# EAGLE schematic EFP01 - Front Panel Board (EAGLE 7.4.0)

## Sheet 1 of 2: MCU
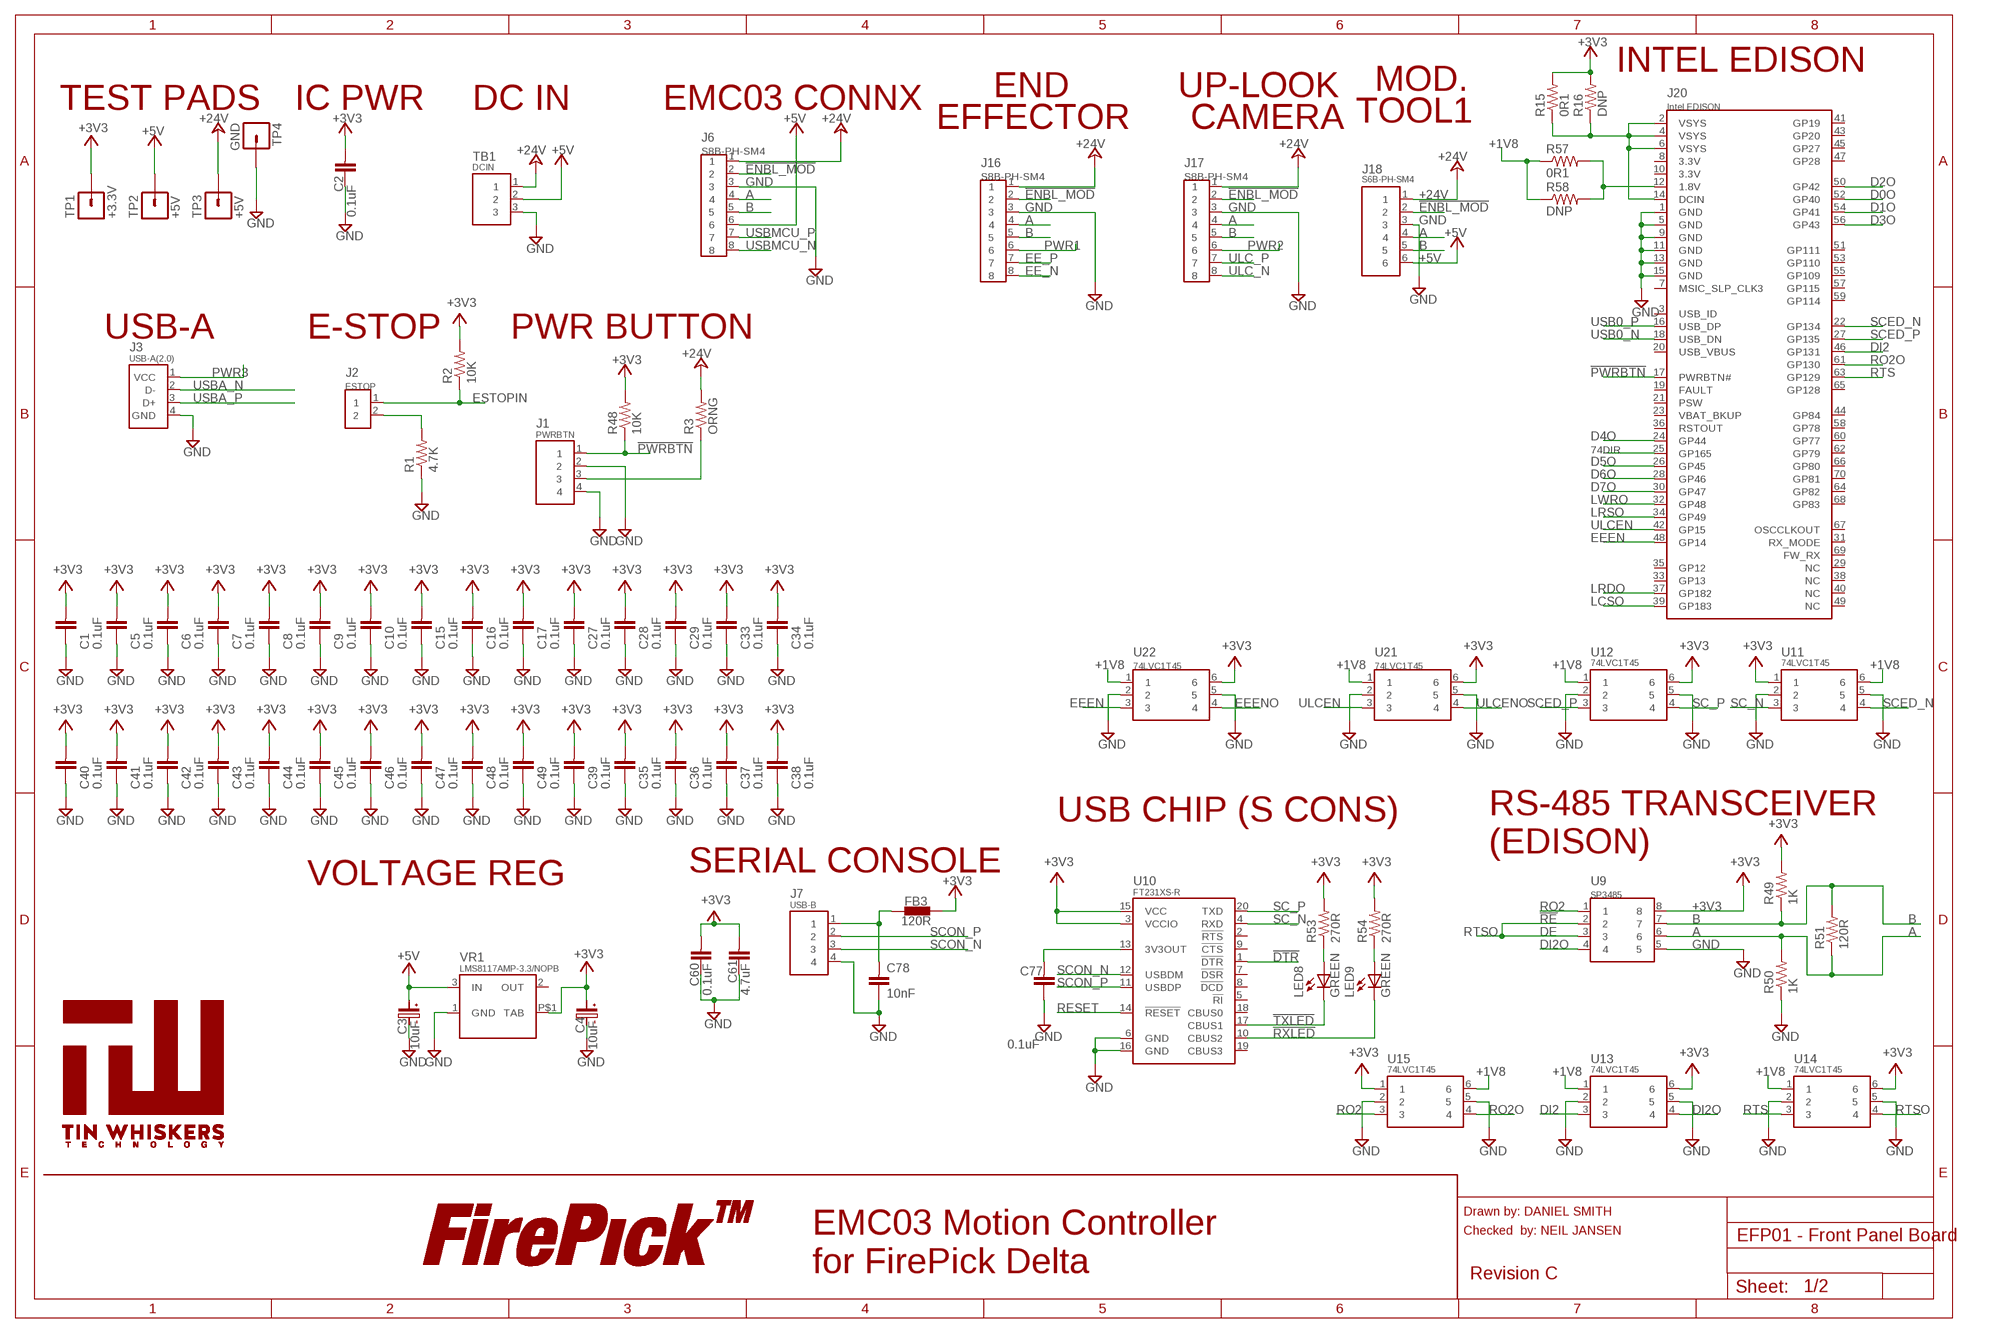
[diagram p0: schematic, sheet 1]

### Parts
C1  0.1uF  CPL-CAP-X5R-0603-0.1UF-35V  [C0603]
C2  0.1uF  CPL-CAP-X5R-0603-0.1UF-35V  [C0603]
C3  10uF  CPL-CAP-ALU-6.4MM-10UF-10V  [C-SMD-6.3MM]
C4  10uF  CPL-CAP-ALU-6.4MM-10UF-10V  [C-SMD-6.3MM]
C5  0.1uF  CPL-CAP-X5R-0603-0.1UF-35V  [C0603]
C6  0.1uF  CPL-CAP-X5R-0603-0.1UF-35V  [C0603]
C7  0.1uF  CPL-CAP-X5R-0603-0.1UF-35V  [C0603]
C8  0.1uF  CPL-CAP-X5R-0603-0.1UF-35V  [C0603]
C9  0.1uF  CPL-CAP-X5R-0603-0.1UF-35V  [C0603]
C10  0.1uF  CPL-CAP-X5R-0603-0.1UF-35V  [C0603]
C15  0.1uF  CPL-CAP-X5R-0603-0.1UF-35V  [C0603]
C16  0.1uF  CPL-CAP-X5R-0603-0.1UF-35V  [C0603]
C17  0.1uF  CPL-CAP-X5R-0603-0.1UF-35V  [C0603]
C27  0.1uF  CPL-CAP-X5R-0603-0.1UF-35V  [C0603]
C28  0.1uF  CPL-CAP-X5R-0603-0.1UF-35V  [C0603]
C29  0.1uF  CPL-CAP-X5R-0603-0.1UF-35V  [C0603]
C33  0.1uF  CPL-CAP-X5R-0603-0.1UF-35V  [C0603]
C34  0.1uF  CPL-CAP-X5R-0603-0.1UF-35V  [C0603]
C35  0.1uF  CPL-CAP-X5R-0603-0.1UF-35V  [C0603]
C36  0.1uF  CPL-CAP-X5R-0603-0.1UF-35V  [C0603]
C37  0.1uF  CPL-CAP-X5R-0603-0.1UF-35V  [C0603]
C38  0.1uF  CPL-CAP-X5R-0603-0.1UF-35V  [C0603]
C39  0.1uF  CPL-CAP-X5R-0603-0.1UF-35V  [C0603]
C40  0.1uF  CPL-CAP-X5R-0603-0.1UF-35V  [C0603]
C41  0.1uF  CPL-CAP-X5R-0603-0.1UF-35V  [C0603]
C42  0.1uF  CPL-CAP-X5R-0603-0.1UF-35V  [C0603]
C43  0.1uF  CPL-CAP-X5R-0603-0.1UF-35V  [C0603]
C44  0.1uF  CPL-CAP-X5R-0603-0.1UF-35V  [C0603]
C45  0.1uF  CPL-CAP-X5R-0603-0.1UF-35V  [C0603]
C46  0.1uF  CPL-CAP-X5R-0603-0.1UF-35V  [C0603]
C47  0.1uF  CPL-CAP-X5R-0603-0.1UF-35V  [C0603]
C48  0.1uF  CPL-CAP-X5R-0603-0.1UF-35V  [C0603]
C49  0.1uF  CPL-CAP-X5R-0603-0.1UF-35V  [C0603]
C60  0.1uF  CPL-CAP-X5R-0603-0.1UF-35V  [C0603]
C61  4.7uF  CPL-CAP-X5R-0603-4.7UF-10V  [C0603]
C77  0.1uF  CPL-CAP-X7R-0603-0.1UF-35V  [C0603]
C78  10nF  CPL-CAP-X7R-10NF-16V  [C0603]
FB3  120R  CPL-IND-FER-120OHM-2A  [F0603]
J1  PWRBTN  CPL-CON-JST-2.0MM-4P-M-SMT-VRT  [CON-JST-PH-2.0MM-4P-SMT-VRT]
J2  ESTOP  CPL-CON-JST-2.0MM-2P-M-SMT-VRT  [CON-JST-PH-2.0MM-2P-SMT-VRT]
J3  USB-A(2.0)  CPL-CON-USB-A-THRU-VERT-2.0  [USB-A-THRU-VERT-2.0]
J6  S8B-PH-SM4  CPL-CON-JST-2.0MM-8P-SMT-VRT  [CON-JST-PH-2.0MM-8P-SMT-VRT]
J7  USB-B  CPL-CON-USB-B-SMT-VERT  [USB-B(SMT)-VERT-1734517]
J16  S8B-PH-SM4  CPL-CON-JST-2.0MM-8P-SMT-VRT  [CON-JST-PH-2.0MM-8P-SMT-VRT]
J17  S8B-PH-SM4  CPL-CON-JST-2.0MM-8P-SMT-VRT  [CON-JST-PH-2.0MM-8P-SMT-VRT]
J18  S6B-PH-SM4  CPL-CON-JST-2.0MM-6P-SMT-VRT  [CON-JST-PH-2.00MM-6P-SMT-VRT]
J20  Intel EDISON  CPL-SBC-INTEL-EDISON  [DF40HC(3.0)-70DS-0.4V(51)]
LED8  GREEN  CPL-LED-0603-GREEN  [LED0603]
LED9  GREEN  CPL-LED-0603-GREEN  [LED0603]
LOGO1  LOGO-FIREPICKLARGE  [LOGO-FIREPICK]
R1  4.7K  CPL-RES-0603-4.7K-0.1W  [R0603]
R2  10K  CPL-RES-0603-10K-0.1W  [R0603]
R3  ORNG  CPL-RES-0603-0-0.1W  [R0603]
R15  0R1  CPL-RES-0603-0.1-0.1W  [R0603]
R16  DNP  CPL-RES-0603-0-0.1W  [R0603]
R48  10K  CPL-RES-0603-10K-0.1W  [R0603]
R49  1K  CPL-RES-0603-1K-0.1W  [R0603]
R50  1K  CPL-RES-0603-1K-0.1W  [R0603]
R51  120R  CPL-RES-0603-120-0.1W  [R0603]
R53  270R  CPL-RES-0603-270-0.1W  [R0603]
R54  270R  CPL-RES-0603-270-0.1W  [R0603]
R57  0R1  CPL-RES-0603-0.1-0.1W  [R0603]
R58  DNP  CPL-RES-0603-0-0.1W  [R0603]
TB1  DCIN  CPL-TBLK-SCR-3CKT-5.0MM-OST  [TBLOCK-3-5MM-OSTTH030160]
TP1  +3.3V  TPAD  [TESTPAD]
TP2  +5V  TPAD  [TESTPAD]
TP3  +5V  TPAD  [TESTPAD]
TP4  GND  TPAD  [TESTPAD]
U9  SP3485  [SOICN-8]
U10  FT231XS-R  CPL-USB-FT2321XS  [20-SSOP]
U11  74LVC1T45  CPL-TRS-74LVC1T45  [SOT-363]
U12  74LVC1T45  CPL-TRS-74LVC1T45  [SOT-363]
U13  74LVC1T45  CPL-TRS-74LVC1T45  [SOT-363]
U14  74LVC1T45  CPL-TRS-74LVC1T45  [SOT-363]
U15  74LVC1T45  CPL-TRS-74LVC1T45  [SOT-363]
U21  74LVC1T45  CPL-TRS-74LVC1T45  [SOT-363]
U22  74LVC1T45  CPL-TRS-74LVC1T45  [SOT-363]
U$1  TIN-WHISKERSTSTOP  [TIN-WHISKERS-TSTOP]
VR1  LMS8117AMP-3.3/NOPB  CPL-REG-LIN-3.3V-1A  [SOT-223]

### Nets
74DIR [power]: J20.25(GP165) ; also sheet 2
!DTR: U10.1(!DTR)
!ENBL_MOD: J6.2 J16.2 J17.2 J18.2
!PWRBTN: J1.1 J20.17(PWRBTN#) R48.1
!RXLED: LED9.C U10.10(CBUS2)
!TXLED: LED8.C U10.17(CBUS1)
+1V8: R57.1 R58.1 U11.6 U12.1 U13.1 U14.1 U15.6 U21.1 U22.1 ; also sheet 2
+3V3: C1.2 C2.2 C4.POS C5.2 C6.2 C7.2 C8.2 C9.2 C10.2 C15.2 C16.2 C17.2 C27.2 C28.2 C29.2 C33.2 C34.2 C35.2 C36.2 C37.2 C38.2 C39.2 C40.2 C41.2 C42.2 C43.2 C44.2 C45.2 C46.2 C47.2 C48.2 C49.2 C60.2 C61.2 FB3.2 R2.2 R15.2 R16.2 R48.2 R49.2 R53.2 R54.2 TP1.PAD U9.8 U10.3(VCCIO) U10.15(VCC) U11.1 U12.6 U13.6 U14.6 U15.1 U21.6 U22.6 VR1.P$1(TAB) ; also sheet 2
+5V [power]: C3.POS J6.6 J18.6 TB1.2 TP2.PAD VR1.3(IN) ; also sheet 2
+24V: J6.1 J16.1 J17.1 J18.1 R3.2 TB1.1 TP3.PAD
A: J6.4 J16.4 J17.4 J18.4 R50.2 R51.1 U9.6
B: J6.5 J16.5 J17.5 J18.5 R49.1 R51.2 U9.7
D0O: J20.52(GP40) ; also sheet 2
D1O: J20.54(GP41) ; also sheet 2
D2O: J20.50(GP42) ; also sheet 2
D3O: J20.56(GP43) ; also sheet 2
D4O: J20.24(GP44) ; also sheet 2
D5O: J20.26(GP45) ; also sheet 2
D6O: J20.28(GP46) ; also sheet 2
D7O: J20.30(GP47) ; also sheet 2
DI2: J20.46(GP131) U13.3
DI2O: U9.4 U13.4
EE_N: J16.8 ; also sheet 2
EE_P: J16.7 ; also sheet 2
EEEN: J20.48(GP14) U22.3
EEENO: U22.4 ; also sheet 2
ESTOPIN: J2.1 R2.1
GND [power]: C1.1 C2.1 C3.NEG C4.NEG C5.1 C6.1 C7.1 C8.1 C9.1 C10.1 C15.1 C16.1 C17.1 C27.1 C28.1 C29.1 C33.1 C34.1 C35.1 C36.1 C37.1 C38.1 C39.1 C40.1 C41.1 C42.1 C43.1 C44.1 C45.1 C46.1 C47.1 C48.1 C49.1 C60.1 C61.1 C77.1 C78.1 J1.2 J1.4 J3.4(GND) J6.3 J7.4 J16.3 J17.3 J18.3 J20.1(GND) J20.5(GND) J20.9(GND) J20.11(GND) J20.13(GND) J20.15(GND) R1.1 R50.1 TB1.3 TP4.PAD U9.5 U10.6(GND) U10.16(GND) U11.2 U11.5 U12.2 U12.5 U13.2 U13.5 U14.2 U14.5 U15.2 U15.5 U21.2 U21.5 U22.2 U22.5 VR1.1(GND) ; also sheet 2
LCSO: J20.39(GP183) ; also sheet 2
LRDO: J20.37(GP182) ; also sheet 2
LRSO: J20.34(GP49) ; also sheet 2
LWRO: J20.32(GP48) ; also sheet 2
N$1: C77.2 U10.13(3V3OUT)
N$2: C78.2 FB3.1 J7.1
N$5: J1.3 R3.1
N$10 [power]: J2.2 R1.2
N$11: LED9.A R54.1
N$13: LED8.A R53.1
N$19: J20.12(1.8V) R57.2 R58.2
N$21: J20.2(VSYS) J20.4(VSYS) J20.6(VSYS) J20.14(DCIN) R15.1 R16.1
PWR1: J16.6 ; also sheet 2
PWR2: J17.6 ; also sheet 2
PWR3: J3.1(VCC) ; also sheet 2
RESET: U10.14(!RESET)
RO2: U9.1 U15.3
RO2O: J20.61(GP130) U15.4
RTS: J20.63(GP129) U14.3
RTSO: U9.2 U9.3 U14.4
SC_N: U10.4(RXD) U11.3
SC_P: U10.20(TXD) U12.4
SCED_N: J20.22(GP134) U11.4
SCED_P: J20.27(GP135) U12.3
SCON_N: J7.3 U10.12(USBDM)
SCON_P: J7.2 U10.11(USBDP)
ULC_N: J17.8 ; also sheet 2
ULC_P: J17.7 ; also sheet 2
ULCEN: J20.42(GP15) U21.3
ULCENO: U21.4 ; also sheet 2
USB0_N: J20.18(USB_DN) ; also sheet 2
USB0_P: J20.16(USB_DP) ; also sheet 2
USBA_N: J3.2(D-) ; also sheet 2
USBA_P: J3.3(D+) ; also sheet 2
USBMCU_N: J6.8 ; also sheet 2
USBMCU_P: J6.7 ; also sheet 2
Unconnected: J20.3(USB_ID) J20.7(MSIC_SLP_CLK3) J20.8(3.3V) J20.10(3.3V) J20.19(FAULT) J20.20(USB_VBUS) J20.21(PSW) J20.23(VBAT_BKUP) J20.29(NC) J20.31(RX_MODE) J20.33(GP13) J20.35(GP12) J20.36(RSTOUT) J20.38(NC) J20.40(NC) J20.41(GP19) J20.43(GP20) J20.44(GP84) J20.45(GP27) J20.47(GP28) J20.49(NC) J20.51(GP111) J20.53(GP110) J20.55(GP109) J20.57(GP115) J20.58(GP78) J20.59(GP114) J20.60(GP77) J20.62(GP79) J20.64(GP82) J20.65(GP128) J20.66(GP80) J20.67(OSCCLKOUT) J20.68(GP83) J20.69(FW_RX) J20.70(GP81) U10.2(!RTS) U10.5(!RI) U10.7(!DSR) U10.8(!DCD) U10.9(!CTS) U10.18(CBUS0) U10.19(CBUS3) VR1.2(OUT)

### Notes on the sheet
- INTEL EDISON
- END | UP-LOOK | MOD.
- TEST PADS | IC PWR | DC IN | EMC03 CONNX
- EFFECTOR | CAMERA | TOOL1
- USB-A | E-STOP | PWR BUTTON
- USB CHIP (S CONS) | RS-485 TRANSCEIVER
- (EDISON)
- SERIAL CONSOLE
- VOLTAGE REG
- !RE
- DE
- Drawn by: DANIEL SMITH
- Checked  by: NEIL JANSEN
- EMC03 Motion Controller
  for FirePick Delta
- Revision C

## Sheet 2 of 2: Peripherals
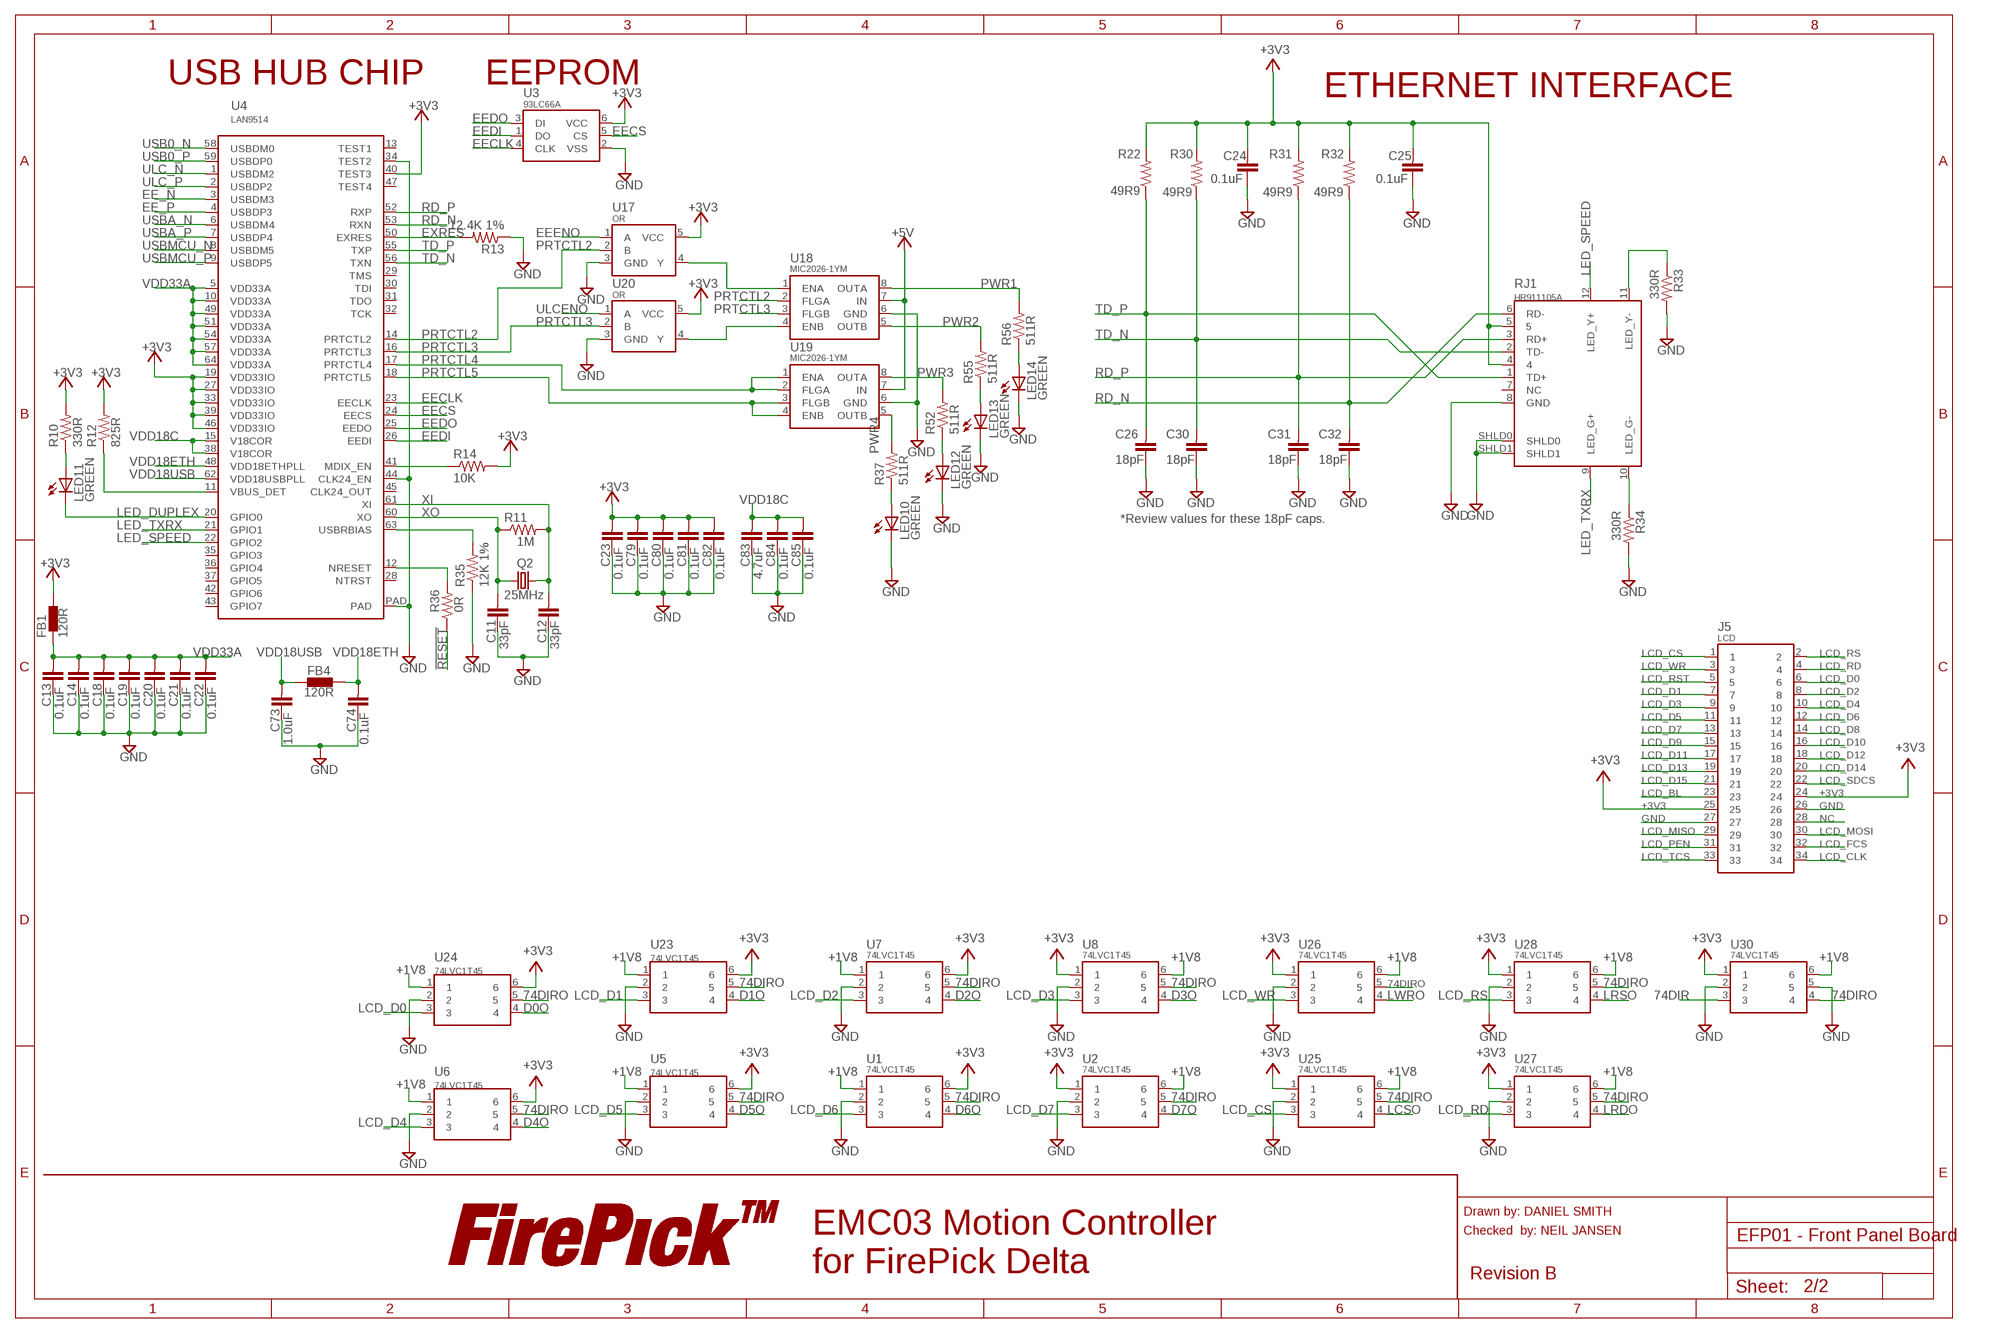
[diagram p1: schematic, sheet 2]

### Parts
C11  33pF  CPL-CAP-C0G-0603-33PF-50V  [C0603]
C12  33pF  CPL-CAP-C0G-0603-33PF-50V  [C0603]
C13  0.1uF  CPL-CAP-X5R-0603-0.1UF-35V  [C0603]
C14  0.1uF  CPL-CAP-X5R-0603-0.1UF-35V  [C0603]
C18  0.1uF  CPL-CAP-X5R-0603-0.1UF-35V  [C0603]
C19  0.1uF  CPL-CAP-X5R-0603-0.1UF-35V  [C0603]
C20  0.1uF  CPL-CAP-X5R-0603-0.1UF-35V  [C0603]
C21  0.1uF  CPL-CAP-X5R-0603-0.1UF-35V  [C0603]
C22  0.1uF  CPL-CAP-X5R-0603-0.1UF-35V  [C0603]
C23  0.1uF  CPL-CAP-X5R-0603-0.1UF-35V  [C0603]
C24  0.1uF  CPL-CAP-X7R-0603-0.1UF-35V  [C0603]
C25  0.1uF  CPL-CAP-X7R-0603-0.1UF-35V  [C0603]
C26  18pF  CPL-CAP-C0G-0603-18PF-50V  [C0603]
C30  18pF  CPL-CAP-C0G-0603-18PF-50V  [C0603]
C31  18pF  CPL-CAP-C0G-0603-18PF-50V  [C0603]
C32  18pF  CPL-CAP-C0G-0603-18PF-50V  [C0603]
C73  1.0uF  CPL-CAP-X5R-0603-1UF-50V  [C0603]
C74  0.1uF  CPL-CAP-X5R-0603-0.1UF-35V  [C0603]
C79  0.1uF  CPL-CAP-X5R-0603-0.1UF-35V  [C0603]
C80  0.1uF  CPL-CAP-X5R-0603-0.1UF-35V  [C0603]
C81  0.1uF  CPL-CAP-X5R-0603-0.1UF-35V  [C0603]
C82  0.1uF  CPL-CAP-X5R-0603-0.1UF-35V  [C0603]
C83  4.7uF  CPL-CAP-X5R-0603-4.7UF-10V  [C0603]
C84  0.1uF  CPL-CAP-X5R-0603-0.1UF-35V  [C0603]
C85  0.1uF  CPL-CAP-X5R-0603-0.1UF-35V  [C0603]
FB1  120R  CPL-IND-FER-120OHM-2A  [F0603]
FB4  120R  CPL-IND-FER-120OHM-2A  [F0603]
J5  LCD  CPL-CON-LCD-HDR-0.1IN-17P2-F  [LCD-34P-3.2IN]
LED10  GREEN  CPL-LED-0603-GREEN  [LED0603]
LED11  GREEN  CPL-LED-0603-GREEN  [LED0603]
LED12  GREEN  CPL-LED-0603-GREEN  [LED0603]
LED13  GREEN  CPL-LED-0603-GREEN  [LED0603]
LED14  GREEN  CPL-LED-0603-GREEN  [LED0603]
LOGO2  LOGO-FIREPICKLARGE  [LOGO-FIREPICK]
Q2  25MHz  CPL-OSC-CRY-25MHZ-18PF  [HC-49/U-S]
R10  330R  CPL-RES-0603-330-0.1W  [R0603]
R11  1M  CPL-RES-0603-1M-0.1W  [R0603]
R12  825R  CPL-RES-0603-825-0.1W  [R0603]
R13  12.4K 1%  CPL-RES-0603-12.4K-0.1W  [R0603]
R14  10K  CPL-RES-0603-10K-0.1W  [R0603]
R22  49R9  CPL-RES-0603-49.9-0.1W  [R0603]
R30  49R9  CPL-RES-0603-49.9-0.1W  [R0603]
R31  49R9  CPL-RES-0603-49.9-0.1W  [R0603]
R32  49R9  CPL-RES-0603-49.9-0.1W  [R0603]
R33  330R  CPL-RES-0603-330-0.1W  [R0603]
R34  330R  CPL-RES-0603-330-0.1W  [R0603]
R35  12K 1%  CPL-RES-0603-12K-0.1W  [R0603]
R36  0R  CPL-RES-0603-0-0.1W  [R0603]
R37  511R  CPL-RES-0603-511-0.1W  [R0603]
R52  511R  CPL-RES-0603-511-0.1W  [R0603]
R55  511R  CPL-RES-0603-511-0.1W  [R0603]
R56  511R  CPL-RES-0603-511-0.1W  [R0603]
RJ1  HR911105A  CPL-ETH-MACJACK-LED-SHLD  [MAGJACK(HR911105A)]
U1  74LVC1T45  CPL-TRS-74LVC1T45  [SOT-363]
U2  74LVC1T45  CPL-TRS-74LVC1T45  [SOT-363]
U3  93LC66A  CPL-MEM-512KB-EEPROM-SOT23-6  [SOT-23-6]
U4  LAN9514  CPL-USB-HUB-LAN9514  [64-QFN]
U5  74LVC1T45  CPL-TRS-74LVC1T45  [SOT-363]
U6  74LVC1T45  CPL-TRS-74LVC1T45  [SOT-363]
U7  74LVC1T45  CPL-TRS-74LVC1T45  [SOT-363]
U8  74LVC1T45  CPL-TRS-74LVC1T45  [SOT-363]
U17  OR  CPL-IC-LOGIC-OR-1CH-74LVC  [SOT-23-5]
U18  MIC2026-1YM  CPL-PWR-SWI-2CH-MIC2026-1XX  [SOIC-8]
U19  MIC2026-1YM  CPL-PWR-SWI-2CH-MIC2026-1XX  [SOIC-8]
U20  OR  CPL-IC-LOGIC-OR-1CH-74LVC  [SOT-23-5]
U23  74LVC1T45  CPL-TRS-74LVC1T45  [SOT-363]
U24  74LVC1T45  CPL-TRS-74LVC1T45  [SOT-363]
U25  74LVC1T45  CPL-TRS-74LVC1T45  [SOT-363]
U26  74LVC1T45  CPL-TRS-74LVC1T45  [SOT-363]
U27  74LVC1T45  CPL-TRS-74LVC1T45  [SOT-363]
U28  74LVC1T45  CPL-TRS-74LVC1T45  [SOT-363]
U30  74LVC1T45  CPL-TRS-74LVC1T45  [SOT-363]

### Nets
74DIR [power]: U30.3 ; also sheet 1
74DIRO: U1.5 U2.5 U5.5 U6.5 U7.5 U8.5 U23.5 U24.5 U25.5 U26.5 U27.5 U28.5 U30.4
!RESET: R36.1
+1V8: U1.1 U2.6 U5.1 U6.1 U7.1 U8.6 U23.1 U24.1 U25.6 U26.6 U27.6 U28.6 U30.6 ; also sheet 1
+3V3: C23.2 C24.2 C25.2 C79.2 C80.2 C81.2 C82.2 FB1.2 J5.24 J5.25 R10.2 R12.2 R14.2 R22.2 R30.2 R31.2 R32.2 RJ1.4 RJ1.5 U1.6 U2.1 U3.6(VCC) U4.19(VDD33IO) U4.27(VDD33IO) U4.33(VDD33IO) U4.39(VDD33IO) U4.40(TEST3) U4.46(VDD33IO) U5.6 U6.6 U7.6 U8.1 U17.5(VCC) U20.5(VCC) U23.6 U24.6 U25.1 U26.1 U27.1 U28.1 U30.1 ; also sheet 1
+5V [power]: U18.7(IN) U19.7(IN) ; also sheet 1
D0O: U24.4 ; also sheet 1
D1O: U23.4 ; also sheet 1
D2O: U7.4 ; also sheet 1
D3O: U8.4 ; also sheet 1
D4O: U6.4 ; also sheet 1
D5O: U5.4 ; also sheet 1
D6O: U1.4 ; also sheet 1
D7O: U2.4 ; also sheet 1
EE_N: U4.3(USBDM3) ; also sheet 1
EE_P: U4.4(USBDP3) ; also sheet 1
EECLK: U3.4(CLK) U4.23(EECLK)
EECS: U3.5(CS) U4.24(EECS)
EEDI: U3.1(DO) U4.26(EEDI)
EEDO: U3.3(DI) U4.25(EEDO)
EEENO: U17.1(A) ; also sheet 1
EXRES: R13.2 U4.50(EXRES)
GND [power]: C11.1 C12.1 C13.1 C14.1 C18.1 C19.1 C20.1 C21.1 C22.1 C23.1 C24.1 C25.1 C26.1 C30.1 C31.1 C32.1 C73.1 C74.1 C79.1 C80.1 C81.1 C82.1 C83.1 C84.1 C85.1 J5.26 J5.27 LED10.C LED12.C LED13.C LED14.C R13.1 R33.2 R34.2 R35.1 RJ1.8(GND) RJ1.SHLD0 RJ1.SHLD1 U1.2 U2.2 U3.2(VSS) U4.34(TEST2) U4.44(CLK24_EN) U4.PAD U5.2 U6.2 U7.2 U8.2 U17.3(GND) U18.6(GND) U19.6(GND) U20.3(GND) U23.2 U24.2 U25.2 U26.2 U27.2 U28.2 U30.2 U30.5 ; also sheet 1
LCD_BL: J5.23
LCD_CLK: J5.34
LCD_CS: J5.1 U25.3
LCD_D0: J5.6 U24.3
LCD_D1: J5.7 U23.3
LCD_D2: J5.8 U7.3
LCD_D3: J5.9 U8.3
LCD_D4: J5.10 U6.3
LCD_D5: J5.11 U5.3
LCD_D6: J5.12 U1.3
LCD_D7: J5.13 U2.3
LCD_D8: J5.14
LCD_D9: J5.15
LCD_D10: J5.16
LCD_D11: J5.17
LCD_D12: J5.18
LCD_D13: J5.19
LCD_D14: J5.20
LCD_D15: J5.21
LCD_FCS: J5.32
LCD_MISO: J5.29
LCD_MOSI: J5.30
LCD_PEN: J5.31
LCD_RD: J5.4 U27.3
LCD_RS: J5.2 U28.3
LCD_RST: J5.5
LCD_SDCS: J5.22
LCD_TCS: J5.33
LCD_WR: J5.3 U26.3
LCSO: U25.4 ; also sheet 1
LED_DUPLEX: LED11.C U4.20(GPIO0)
LED_SPEED: RJ1.12(LED_Y+) U4.22(GPIO2)
LED_TXRX: RJ1.9(LED_G+) U4.21(GPIO1)
LRDO: U27.4 ; also sheet 1
LRSO: U28.4 ; also sheet 1
LWRO: U26.4 ; also sheet 1
N$3: LED11.A R10.1
N$6: R12.1 U4.11(VBUS_DET)
N$7: R33.1 RJ1.11(LED_Y-)
N$8: R34.1 RJ1.10(LED_G-)
N$15: R36.2 U4.12(NRESET)
N$18: R14.1 U4.41(MDIX_EN)
N$22: U17.4(Y) U18.1(ENA)
N$27: R35.2 U4.63(USBRBIAS)
N$28: LED10.A R37.1
N$29: LED12.A R52.1
N$30: LED13.A R55.1
N$31: LED14.A R56.1
N$42: U18.4(ENB) U20.4(Y)
NC: J5.28
PRTCTL2: U4.14(PRTCTL2) U17.2(B) U18.2(FLGA)
PRTCTL3: U4.16(PRTCTL3) U18.3(FLGB) U20.2(B)
PRTCTL4: U4.17(PRTCTL4) U19.1(ENA) U19.2(FLGA)
PRTCTL5: U4.18(PRTCTL5) U19.3(FLGB) U19.4(ENB)
PWR1: R56.2 U18.8(OUTA) ; also sheet 1
PWR2: R55.2 U18.5(OUTB) ; also sheet 1
PWR3: R52.2 U19.8(OUTA) ; also sheet 1
PWR4: R37.2 U19.5(OUTB)
RD_N: C32.2 R32.1 RJ1.6(RD-) U4.53(RXN)
RD_P: C31.2 R31.1 RJ1.3(RD+) U4.52(RXP)
TD_N: C30.2 R30.1 RJ1.2(TD-) U4.56(TXN)
TD_P: C26.2 R22.1 RJ1.1(TD+) U4.55(TXP)
ULC_N: U4.1(USBDM2) ; also sheet 1
ULC_P: U4.2(USBDP2) ; also sheet 1
ULCENO: U20.1(A) ; also sheet 1
USB0_N: U4.58(USBDM0) ; also sheet 1
USB0_P: U4.59(USBDP0) ; also sheet 1
USBA_N: U4.6(USBDM4) ; also sheet 1
USBA_P: U4.7(USBDP4) ; also sheet 1
USBMCU_N: U4.8(USBDM5) ; also sheet 1
USBMCU_P: U4.9(USBDP5) ; also sheet 1
VDD18C: C83.2 C84.2 C85.2 U4.15(V18COR) U4.38(V18COR)
VDD18ETH: C74.2 FB4.2 U4.48(VDD18ETHPLL)
VDD18USB: C73.2 FB4.1 U4.62(VDD18USBPLL)
VDD33A: C13.2 C14.2 C18.2 C19.2 C20.2 C21.2 C22.2 FB1.1 U4.5(VDD33A) U4.10(VDD33A) U4.49(VDD33A) U4.51(VDD33A) U4.54(VDD33A) U4.57(VDD33A) U4.64(VDD33A)
XI: C12.2 Q2.2 R11.2 U4.61(XI)
XO: C11.2 Q2.1 R11.1 U4.60(XO)
Unconnected: RJ1.7(NC) U4.13(TEST1) U4.28(NTRST) U4.29(TMS) U4.30(TDI) U4.31(TDO) U4.32(TCK) U4.35(GPIO3) U4.36(GPIO4) U4.37(GPIO5) U4.42(GPIO6) U4.43(GPIO7) U4.45(CLK24_OUT) U4.47(TEST4)

### Notes on the sheet
- USB HUB CHIP | EEPROM
- ETHERNET INTERFACE
- *Review values for these 18pF caps.
- Drawn by: DANIEL SMITH
- Checked  by: NEIL JANSEN
- EMC03 Motion Controller
  for FirePick Delta
- Revision B

## Library data of the parts
C1 C2 C5-C10 C13-C23 C27-C29 C33-C49 C60 C74 C79-C82 C84 C85 = TinWhiskers:CPL-CAP-X5R-0603-0.1UF-35V: Capacitor: 0.1uF, 35V, 10%, X5R; Package: 0603; Datasheet: http://www.yuden.co.jp/productdata/catalog/en/mlcc01_hq_e.pdf; PARTNO: GMK107BJ104KAHT
C3 C4 = TinWhiskers:CPL-CAP-ALU-6.4MM-10UF-10V: Capacitor: Al-Electrolytic, 10uF, 10V 20$; Package: 6.3MM SMT (Can); Datasheet: http://www.ti.com/lit/ds/symlink/lms8117a.pdf; PARTNO: EMVH350ADA100MF60G
C11 C12 = TinWhiskers:CPL-CAP-C0G-0603-33PF-50V: Capacitor: 33pF, 50V, 5%, C0G; Package: 0603; Datasheet: http://www.mouser.com/ds/2/212/KEM_C1003_C0G_SMD-356956.pdf; PARTNO: C0603C330K5GACTU
C24 C25 C77 = TinWhiskers:CPL-CAP-X7R-0603-0.1UF-35V: Capacitor: 0.1uF, 35V, 10%, X7R; Package: 0603; Datasheet: http://www.yuden.co.jp/productdata/catalog/en/mlcc01_hq_e.pdf; PARTNO: GMK107BJ104KAHT
C26 C30-C32 = TinWhiskers:CPL-CAP-C0G-0603-18PF-50V: Capacitor: 18pF, 50V, 5%; Package: 0603; Datasheet: http://www.mouser.com/ds/2/427/vjw1bcbascomseries-223529.pdf; PARTNO: GCM1885C1H180JA16D
C61 C83 = TinWhiskers:CPL-CAP-X5R-0603-4.7UF-10V: Capacitor: 4.7uF, 10V, 10% Package: 0603; Datasheet: http://www.yuden.co.jp/productdata/catalog/en/mlcc_all_e.pdf; PARTNO: GRM188C81E475KE11D
C73 = TinWhiskers:CPL-CAP-X5R-0603-1UF-50V: Capacitor: 1uF, 50V, 10%; Package: 0603; Datasheet: http://www.mouser.com/ds/2/396/mlcc_all_e-541559.pdf; PARTNO: UMK107AB7105KA-T
C78 = TinWhiskers:CPL-CAP-X7R-10NF-16V: Capacitor: 10nF(0.01uF), 16V, 5%; Package: 0603; Datasheet: http://www.mouser.com/ds/2/396/mlcc_all_e-541559.pdf; PARTNO: GRM188R71H103KA01D
FB1 FB3 FB4 = TinWhiskers:CPL-IND-FER-120OHM-2A: Ferrite Bead: 120 Ohm, 2A, 25%; Package: 0603; Datasheet: http://www.mouser.com/ds/2/281/c31e-522703.pdf P/N: BLM18PG121SN1D; PARTNO: BLM18AG121SN1D
J1 = TinWhiskers:CPL-CON-JST-2.0MM-4P-M-SMT-VRT: Connector: 2.0MM Pitch, 2-Pin; Package: SMT, Vertical; Datasheet: http://www.jst-mfg.com/product/pdf/eng/ePH.pdf; PARTNO: S4B-PH-SM4-TB(LF)(SN)
J2 = TinWhiskers:CPL-CON-JST-2.0MM-2P-M-SMT-VRT: Connector: 2.0MM Pitch, 2-Pin; Package: SMT, Vertical; Datasheet: http://www.jst-mfg.com/product/pdf/eng/ePH.pdf; PARTNO: S2B-PH-SM4-TB(LF)(SN)
J3 = TinWhiskers:CPL-CON-USB-A-THRU-VERT-2.0: Connector: USB-A (2.0), (TE: 1734085-1); Package: Thru-Hole, Vertical; Datasheet: http://www.digikey.com/product-detail/en/1734085-1/A114935-ND/2286634; PARTNO: 1734085-1
J5 = TinWhiskers:CPL-CON-LCD-HDR-0.1IN-17P2-F: Connector: Header, 0.1" Pitch, 17x2P, Package: Thru-Hole, Vertical; Datasheet:; PARTNO: TSW-117-07-T-D
J6 J16 J17 = TinWhiskers:CPL-CON-JST-2.0MM-8P-SMT-VRT: Connector: 2.0MM Pitch, 2-Pin; Package: SMT, Vertical; Datasheet: http://www.jst-mfg.com/product/pdf/eng/ePH.pdf; PARTNO: B8B-PH-SM4-TB(LF)(SN)
J7 = TinWhiskers:CPL-CON-USB-B-SMT-VERT: Connector: USB-B, Board-MT; Package: SMT, Vertical; Datasheet: http://www.digikey.com/product-detail/en/1734517-1/A111053CT-ND/4142437; PARTNO: 1734517-1
J18 = TinWhiskers:CPL-CON-JST-2.0MM-6P-SMT-VRT: Connector: 2.0MM Pitch, 2-Pin; Package: SMT, Vertical; Datasheet: http://www.jst-mfg.com/product/pdf/eng/ePH.pdf; PARTNO: B6B-PH-SM4-TB(LF)(SN)
J20 = TinWhiskers:CPL-SBC-INTEL-EDISON: Single-Board Computer: Intel Edison, 70-Pin receptacle connector; Package: SMT, Vertical; Datasheet: http://akizukidenshi.com/download/ds/intel/edison-module_HG_331189-002.pdf; PARTNO: DF40HC(3.0)-70DS-0.4V(51)
LED8-LED14 = TinWhiskers:CPL-LED-0603-GREEN: LED: Green; Package: 0603; PARTNO: SML-D12M8WT86
LOGO1 LOGO2 = FirePick:LOGO-FIREPICK; BOM: EXCLUDE; DNP: T
Q2 = TinWhiskers:CPL-OSC-CRY-25MHZ-18PF: Crystal Oscillator: 25MHz, 18pF, 30PPM; Package: HC-49/U-S; Datasheet: http://www.mouser.com/ds/2/77/HCM49-5106.pdf; PARTNO: HCM4925000000MABJ
R1 = TinWhiskers:CPL-RES-0603-4.7K-0.1W: Resistor: 4.7 kOhm, 0.1W, 1%; Package: 0603; Datasheet: http://www.mouser.com/ds/2/315/AOA0000CE2-37512.pdf; PARTNO: RC0603FR-074K7L
R2 R14 R48 = TinWhiskers:CPL-RES-0603-10K-0.1W: Resistor: 10kOhm, 0.1W, 1%; Package: 0603; Datasheet: http://www.mouser.com/ds/2/315/AOA0000CE2-37512.pdf; PARTNO: RC0603FR-0710KL
R3 R16 R36 R58 = TinWhiskers:CPL-RES-0603-0-0.1W: Resistor: 0 Ohm, 0.1W, 5%; Specs: http://www.mouser.com/ds/2/315/AOA0000CE1-37422.pdf; PARTNO: RC0603JR-070RL
R10 R33 R34 = TinWhiskers:CPL-RES-0603-330-0.1W: Resistor: 330Ohm, 0.1W, 5%; Package: 0603; Datasheet: http://www.mouser.com/ds/2/427/dcrcwe3-109170.pdf; PARTNO: RC0603FR-07330RL
R11 = TinWhiskers:CPL-RES-0603-1M-0.1W: Resistor: 1MOhm, 0.1W, 5%; Package: 0603; Datasheet: http://www.samsungsem.com/global/support/library/product-catalog/__icsFiles/afieldfile/2015/01/12/CHIP_RESISTOR_150112_1.pdf; PARTNO: RC0603FR-071ML
R12 = TinWhiskers:CPL-RES-0603-825-0.1W: Resistor: 825 Ohm, 0.1W, 1%; Package: 0603; Datasheet: http://www.vishay.com/docs/20035/dcrcwe3.pdf; PARTNO: RC0603FR-07825RL
R13 = TinWhiskers:CPL-RES-0603-12.4K-0.1W: Resistor: 12.4 kOhm, 0.1W, 1%; Package: 0603; Datasheet: http://www.vishay.com/docs/20035/dcrcwe3.pdf; PARTNO: RC0603FR-0712K4L
R15 R57 = TinWhiskers:CPL-RES-0603-0.1-0.1W: Resistor: 0.1 Ohm, 0.1W, 1%; Package: 0603; Datasheet: http://www.yageo.com/documents/recent/PYu-RL_521_RoHS_L_5.pdf; PARTNO: RL0603FR-070R1L
R22 R30-R32 = TinWhiskers:CPL-RES-0603-49.9-0.1W: Resistor: 49.9Ohms, 0.1W, 1%; Package: 0603; Datasheet: http://www.mouser.com/ds/2/219/RN73H-12200.pdf; PARTNO: RC0603FR-0749R9L
R35 = TinWhiskers:CPL-RES-0603-12K-0.1W: Resistor: 12 kOhms, 0.1W, 1%; Package: 0603; Datasheet: http://www.yageo.com/NewPortal/yageodocoutput?fileName=/pdf/R-Chip/PYu-RC_Group_51_RoHS_L_3.pdf; PARTNO: RC0603FR-0712KL
R37 R52 R55 R56 = TinWhiskers:CPL-RES-0603-511-0.1W: Resistor: 511 Ohm, 0.1W, 1%; Package: 0603; Datasheet: http://www.yageo.com/NewPortal/yageodocoutput?fileName=/pdf/R-Chip/PYu-RC_Group_51_RoHS_L_3.pdf; PARTNO: RC0603FR-07511RL
R49 R50 = TinWhiskers:CPL-RES-0603-1K-0.1W: Resistor: 1 kOhm, 0.1W, 1%; Package: 0603; Datasheet: http://www.yageo.com/NewPortal/yageodocoutput?fileName=/pdf/R-Chip/PYu-RC_Group_51_RoHS_L_3.pdf; PARTNO: RC0603FR-071KL
R51 = TinWhiskers:CPL-RES-0603-120-0.1W: Resistor: 120 Ohm, 0.1W, 1%; Package: 0603 (SMT); Datasheet:; PARTNO: RC0603FR-07120RL
R53 R54 = TinWhiskers:CPL-RES-0603-270-0.1W: Resistor: 270 Ohms, 0.1W, 1%; Package: 0603; Datasheet:; PARTNO: RC0603FR-07270RL
RJ1 = TinWhiskers:CPL-ETH-MACJACK-LED-SHLD: Connector: Ethernet, MagJack, RJ-45, Status LEDs+Shield; Datasheet: http://www.kosmodrom.com.ua/pdf/HR911105A.pdf; PARTNO: HR911105A
TB1 = TinWhiskers:CPL-TBLK-SCR-3CKT-5.0MM-OST: Terminal Block: Screws, 3-Circuit, 300kV (OSTTH030160); Package: Thru-Hole, R/A, Green; Datasheet: http://www.on-shore.com/sites/default/files/manuals/ostthxx0160.pdf; PARTNO: OSTTH030160
TP1-TP4 = TinWhiskers:TPAD: Testpad (1mm x 1mm); DNP: T; PARTNO: N/A
U1 U2 U5-U8 U11-U15 U21-U28 U30 = TinWhiskers:CPL-TRS-74LVC1T45: Transceiver: Supply Translator (Logic); Package: SOT-363; Datasheet: http://www.nxp.com/documents/data_sheet/74LVC_LVCH1T45.pdf; PARTNO: 74LVC1T45GW,125
U3 = TinWhiskers:CPL-MEM-512KB-EEPROM-SOT23-6: EEPROM: 512x8; Package: SOT-23-6; Datasheet: http://ww1.microchip.com/downloads/en/DeviceDoc/21795b.pdf; PARTNO: 93LC66A-I/SN
U4 = TinWhiskers:CPL-USB-HUB-LAN9514: USB Hub: 4-Hub, LAN9514; Package: 64-QFN; Datasheet: http://ww1.microchip.com/downloads/en/DeviceDoc/9514.pdf; PARTNO: LAN9514-JZX
U9 = TinWhiskers:SP3485: Transceiver: RS-485 Chip; Package: SOICN-8; Datasheet: http://www.exar.com/common/content/document.ashx?id=639; PARTNO: SP3485
U10 = TinWhiskers:CPL-USB-FT2321XS: IC: USB-to-UART (Full Handshake), +5V; Package: 20-SSOP; Datasheet: http://www.ftdichip.com/Support/Documents/DataSheets/ICs/DS_FT231X.pdf; PARTNO: FT231XS-R
U17 U20 = TinWhiskers:CPL-IC-LOGIC-OR-1CH-74LVC: Logic Gate: OR, 1-Channel; Package: SOT23-5; Datasheet: http://www.ti.com/lit/ds/symlink/sn74lvc1g32.pdf; PARTNO: SN74LVC1G32DBVR
U18 U19 = TinWhiskers:CPL-PWR-SWI-2CH-MIC2026-1XX: Pwr Dist. Switch: 2-Channel, 2.7V-5.5V, 500mA/channel; Package: 8-SOIC; Datasheet: http://www.micrel.com/_PDF/mic2026.pdf; PARTNO: MIC2026-1YM
U$1 = !tin-whiskers-logo:TIN-WHISKERS; PARTNO: *
VR1 = TinWhiskers:CPL-REG-LIN-3.3V-1A: Voltage Regulator: 3.3V, 1A (TI: LMS8117AMP-3.3/NOPB); Package: TO223; Datasheet: http://www.ti.com/lit/ds/symlink/lms8117a.pdf; PARTNO: LMS8117AMP-3.3/NOPB

## Net classes
0 default: width 0.152 mm, drill 0.305 mm, clearance 0.152 mm